# Altium project KNOCKLET_BRAC.PrjPcb
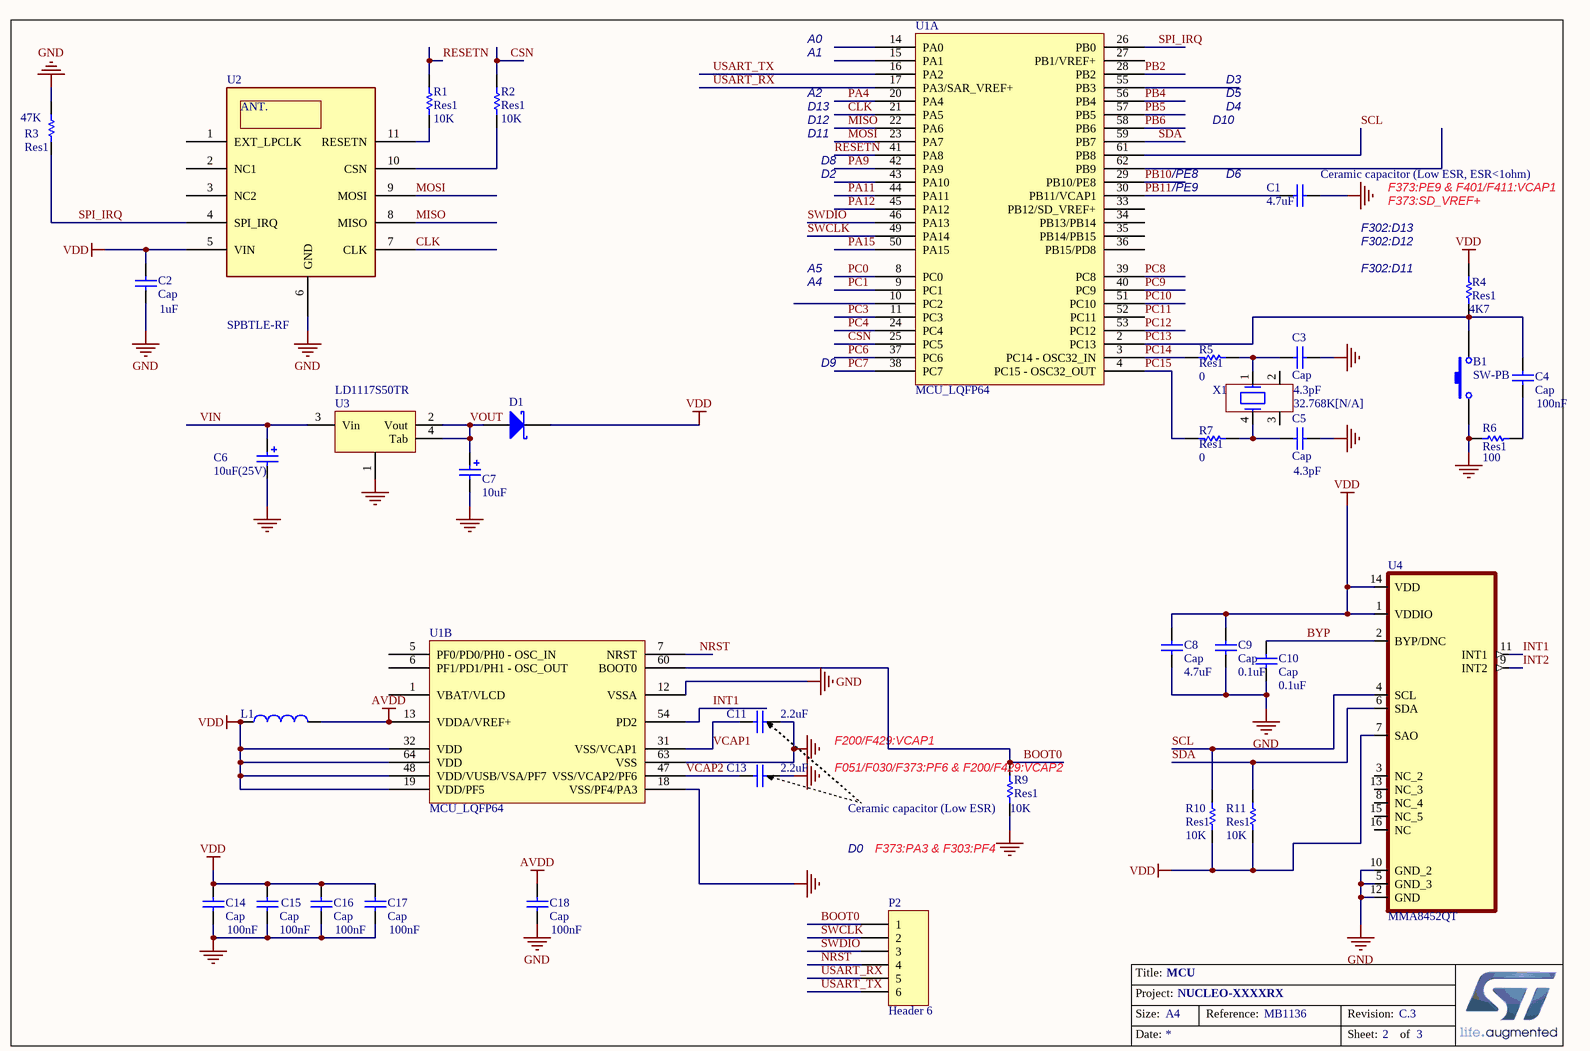
[diagram p0: Copy of MCU_64.SchDoc]
1 sheet, 36 parts. Net scope: global (net labels, ports and power ports of the same name join across sheets).
Board files: Bracelet.PcbDoc, logo.PcbDoc

## Sheet Copy of MCU_64.SchDoc: MCU
size A4; DocumentNumber: MB1136; Revision: C.3; SheetNumber: 2; SheetTotal: 3; Project: NUCLEO-XXXXRX

### Parts
B1  SW-PB  [SPST-2]
C1  4.7uF  [TAN-A]
C2  Cap  value 1uF  [0603[IMP]-CAP]
C3  Cap  value 4.3pF  [0603[IMP]-CAP]
C4  Cap  value 100nF  [0603[IMP]-CAP]
C5  Cap  value 4.3pF  [0603[IMP]-CAP]
C6  10uF(25V)  [TAN-B]
C7  10uF  [TAN-A]
C8  Cap  value 4.7uF  [0603[IMP]-CAP]
C9  Cap  value 0.1uF  [0603[IMP]-CAP]
C10  Cap  value 0.1uF  [0603[IMP]-CAP]
C11  2.2uF  [TAN-A]
C13  2.2uF  [TAN-A]
C14  Cap  value 100nF  [0603[IMP]-CAP]
C15  Cap  value 100nF  [0603[IMP]-CAP]
C16  Cap  value 100nF  [0603[IMP]-CAP]
C17  Cap  value 100nF  [0603[IMP]-CAP]
C18  Cap  value 100nF  [0603[IMP]-CAP]
D1  (no value)  [SMB]
L1  (no value)  [0603[IMP]-CAP]
P2  Header 6  [HDR1X6]
R1  Res1  value 10K  [0603[IMP]-RES]
R2  Res1  value 10K  [0603[IMP]-RES]
R3  Res1  value 47K  [0603[IMP]-RES]
R4  Res1  value 4K7  [0603[IMP]-RES]
R5  Res1  value 0  [0603[IMP]-RES]
R6  Res1  value 100  [0603[IMP]-RES]
R7  Res1  value 0  [0603[IMP]-RES]
R9  Res1  value 10K  [0603[IMP]-RES]
R10  Res1  value 10K  [0603[IMP]-RES]
R11  Res1  value 10K  [0603[IMP]-RES]
U1  MCU_LQFP64  [LQFP64]  (parts A,B of 2)
U2  SPBTLE-RF  [SPBTLE-RF]
U3  LD1117S50TR  [SOT223_N]
U4  MMA8452QT  [MMA8452QT]
X1  32.768K[N/A]  [Quartz_ABS25]

### Nets
AVDD: C18.1 L1.2 U1.13(VDDA/VREF+)
GND: B1.1 C1.2 C2.1 C3.1 C5.1 C6.2 C7.2 C8.1 C9.1 C10.1 C11.2 C13.2 C14.2 C15.2 C16.2 C17.2 C18.2 R3.2 R6.1 R9.2 U1.12(VSSA) U1.18(VSS/PF4/PA3) U1.63(VSS) U2.6(GND) U3.1 U4.5(GND_3) U4.10(GND_2) U4.12(GND)
VDD: C2.2 C8.2 C9.2 C14.1 C15.1 C16.1 C17.1 D1.2(K) L1.1 R4.2 R10.1 R11.1 U1.19(VDD/PF5) U1.32(VDD) U1.48(VDD/VUSB/VSA/PF7) U1.64(VDD) U2.5(VIN) U4.1(VDDIO) U4.7(SAO) U4.14(VDD)
BOOT0: P2.1 R9.1 U1.60(BOOT0)
BYP: C10.2 U4.2(BYP/DNC)
CLK: U1.21(PA5) U2.7(CLK)
CSN: R2.2 U1.25(PC5)
INT1: U1.54(PD2) U4.11(INT1)
INT2: U4.9(INT2)
MISO: U1.22(PA6) U2.8(MISO)
MOSI: U1.23(PA7) U2.9(MOSI)
NRST: P2.4 U1.7(NRST)
PA4: U1.20(PA4)
PA9: U1.42(PA9)
PA11: U1.44(PA11)
PA12: U1.45(PA12)
PA15: U1.50(PA15)
PB2: U1.28(PB2)
PB4: U1.56(PB4)
PB5: U1.57(PB5)
PB6: U1.58(PB6)
PB10: U1.29(PB10/PE8)
PB11: C1.1 U1.30(PB11/VCAP1)
PC0: U1.8(PC0)
PC1: U1.9(PC1)
PC3: U1.11(PC3)
PC4: U1.24(PC4)
PC6: U1.37(PC6)
PC7: U1.38(PC7)
PC8: U1.39(PC8)
PC9: U1.40(PC9)
PC10: U1.51(PC10)
PC11: U1.52(PC11)
PC12: U1.53(PC12)
PC13: B1.2 C4.2 R4.1 U1.2(PC13)
PC14: R5.1 U1.3(PC14_-_OSC32_IN)
PC15: R7.1 U1.4(PC15_-_OSC32_OUT)
RESETN: R1.2 U1.41(PA8)
SCL: R10.2 U1.61(PB8) U4.4(SCL)
SDA: R11.2 U1.59(PB7) U4.6(SDA)
SPI_IRQ: R3.1 U1.26(PB0) U2.4(SPI_IRQ)
SWCLK: P2.2 U1.49(PA14)
SWDIO: P2.3 U1.46(PA13)
USART_RX: P2.5 U1.17(PA3/SAR_VREF+)
USART_TX: P2.6 U1.16(PA2)
VCAP1: C11.1 U1.31(VSS/VCAP1)
VCAP2: C13.1 U1.47(VSS/VCAP2/PF6)
VIN: C6.1 U3.3(Vin)
VOUT: C7.1 D1.1(A) U3.2(Vout) U3.4(Tab)
NetC3_2: C3.2 R5.2 X1.1
NetC4_1: C4.1 R6.2
NetC5_2: C5.2 R7.2 X1.4
NetR1_1: R1.1 U2.11(RESETN)
NetR2_1: R2.1 U2.10(CSN)

Not connected (* = marked no-connect by the designer): U1 1(VBAT/VLCD) 5(PF0/PD0/PH0_-_OSC_IN) 6(PF1/PD1/PH1_-_OSC_OUT) 10(PC2) 14(PA0) 15(PA1) 27(PB1/VREF+) 33(PB12/SD_VREF+) 34(PB13/PB14) 35(PB14/PB15) 36(PB15/PD8) 43(PA10) 55(PB3) 62(PB9); U2 1(EXT_LPCLK) 2(NC1) 3(NC2); U4 3(NC_2) 8(NC_4) 13(NC_3) 15(NC_5) 16(NC); X1 2 3

### Notes on the sheet
- A0
- A1
- A2
- D12
- D13
- D10
- D4
- D3
- D5
- D11
- D2
- D8
- /PE9
- /PE8
- D6
- (near C1) Ceramic capacitor (Low ESR, ESR<1ohm)
- F373:PE9 & F401/F411:VCAP1
- F302:D12
- F302:D13
- F373:SD_VREF+
- A4
- A5
- F302:D11
- D9
- F200/F429:VCAP1
- (near R9) F051/F030/F373:PF6 & F200/F429:VCAP2
- D0
- (near R9) Ceramic capacitor (Low ESR)
- F373:PA3 & F303:PF4
- Title:
- Project:
- Size:
- Date:
- Reference:
- Sheet:
- Revision:
- of
- (in symbol SPBTLE-RF) ANT.

### Library data of the parts
B1 = SW-PB: Switch; Published: 24-Mar-1999; LatestRevisionDate: 17-Jul-2002; LatestRevisionNote: Re-released for DXP Platform.; PackageReference: SPST-2; Publisher: Altium Limited; PackageDescription: Switch; 2 Leads
C1 = Cap_2.2uF_X7R_10%_0805: Capacitor,4.7uF,25V, X7R,10%,1206,YAGEO; Manuf_Part_1: CC0805KKX7R7BB225; Value: 2.2uF; Revision: July-2002: Re-released for DXP Platform.; Order: CC0805KKX7R7BB225; Manuf_1: YAGEO
C2-C5 C8-C10 C14-C18 = Cap: Capacitor; Price: *; Ref. Manufacturer: *; Ref. Supplier: *; Supplier: *; Manufacturer: *
C6 C7 = Cap Pol1: Polarized Capacitor (Radial); Published: 8-Jun-2000; Revision: July-2002: Re-released for DXP Platform.; Publisher: Altium Limited; Value: 10uF
C11 C13 = Cap_2.2uF_X7R_10%_0805: Capacitor,2.2uF,16V, X7R,10%,0805,YAGEO; Manuf_Part_1: CC0805KKX7R7BB225; Revision: July-2002: Re-released for DXP Platform.; Value: 2.2uF; Order: CC0805KKX7R7BB225; Manuf_1: YAGEO
D1 = D Schottky: Schottky Diode; Published: 8-Jun-2000; LatestRevisionDate: 17-Jul-2002; LatestRevisionNote: Re-released for DXP Platform.; PackageReference: SMB; Publisher: Altium Limited; PackageDescription: DO-214-AA/SMB; 2 C-Bend Leads; Body 5.3 x 3.6 mm, inc. leads (LxW); Code_JEDEC: DO-214-AA
L1 = Inductor: Value: 10mH; Code_IEC: 1005; Published: 8-Jun-2000; Publisher: Altium Limited; LatestRevisionDate: 29-May-2009; LatestRevisionNote: IPC-7351 Footprint Added.; PackageReference: 0402-A; PackageDescription: Chip Inductor; Code_JEITA: 0402
P2 = Header 6: Header, 6-Pin; LatestRevisionDate: 17-Jul-2002; LatestRevisionNote: Re-released for DXP Platform.; Publisher: Altium Limited
R1-R7 R9-R11 = Res1: Resistor; Published: 8-Jun-2000; LatestRevisionDate: 17-Jul-2002; LatestRevisionNote: Re-released for DXP Platform.; PackageReference: AXIAL-0.3; Publisher: Altium Limited; PackageDescription: Axial Device, Thru-Hole; 2 Leads; 0.3 in Pin Spacing
U2 = SPBTLE-RF: Module BlueNRG
U3 = LD1117
X1 = MC306